# Altium schematic sheet HCF4051.SchDoc
size A4
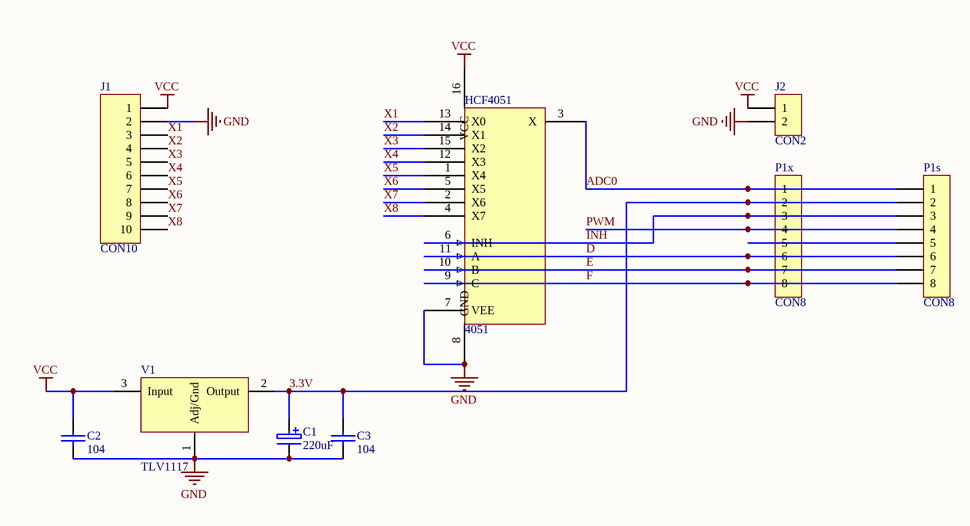
[diagram p0: HCF4051.SchDoc]

## Parts
C1  220uF  [CAO1]
C2  104  [C0805]
C3  104  [C0805]
HCF4051  4051  [SOP-16]
J1  CON10  [sip-10]
J2  CON2  [sip-2]
P1s  CON8  [sip-8]
P1x  CON8  [sip-8]
V1  TLV1117  [SOT-223]

## Nets
GND: C1.2 C2.1 C3.1 HCF4051.7(VEE) HCF4051.8(GND) J1.2 J2.2 V1.1(Adj/Gnd)
VCC: C2.2 HCF4051.16(VCC) J1.1 J2.1 V1.3(Input)
3.3V: C1.1 C3.2 P1s.2 P1x.2 V1.2(Output)
ADC0: HCF4051.3(X) P1s.1 P1x.1
D: HCF4051.11(A) P1s.6 P1x.6
E: HCF4051.10(B) P1s.7 P1x.7
F: HCF4051.9(C) P1s.8 P1x.8
INH: HCF4051.6(INH) P1s.3 P1x.3
PWM: P1s.4 P1x.4
X1: HCF4051.13(X0) J1.3
X2: HCF4051.14(X1) J1.4
X3: HCF4051.15(X2) J1.5
X4: HCF4051.12(X3) J1.6
X5: HCF4051.1(X4) J1.7
X6: HCF4051.5(X5) J1.8
X7: HCF4051.2(X6) J1.9
X8: HCF4051.4(X7) J1.10
NetP1s_5: P1s.5 P1x.5

## Library data of the parts
C1 = CAP3
C2 C3 = CAP1
J1 = CON10: Connector
J2 = CON2: Connector
P1s P1x = CON8: Connector